# EAGLE schematic HendiRemote (EAGLE 9.6.2)
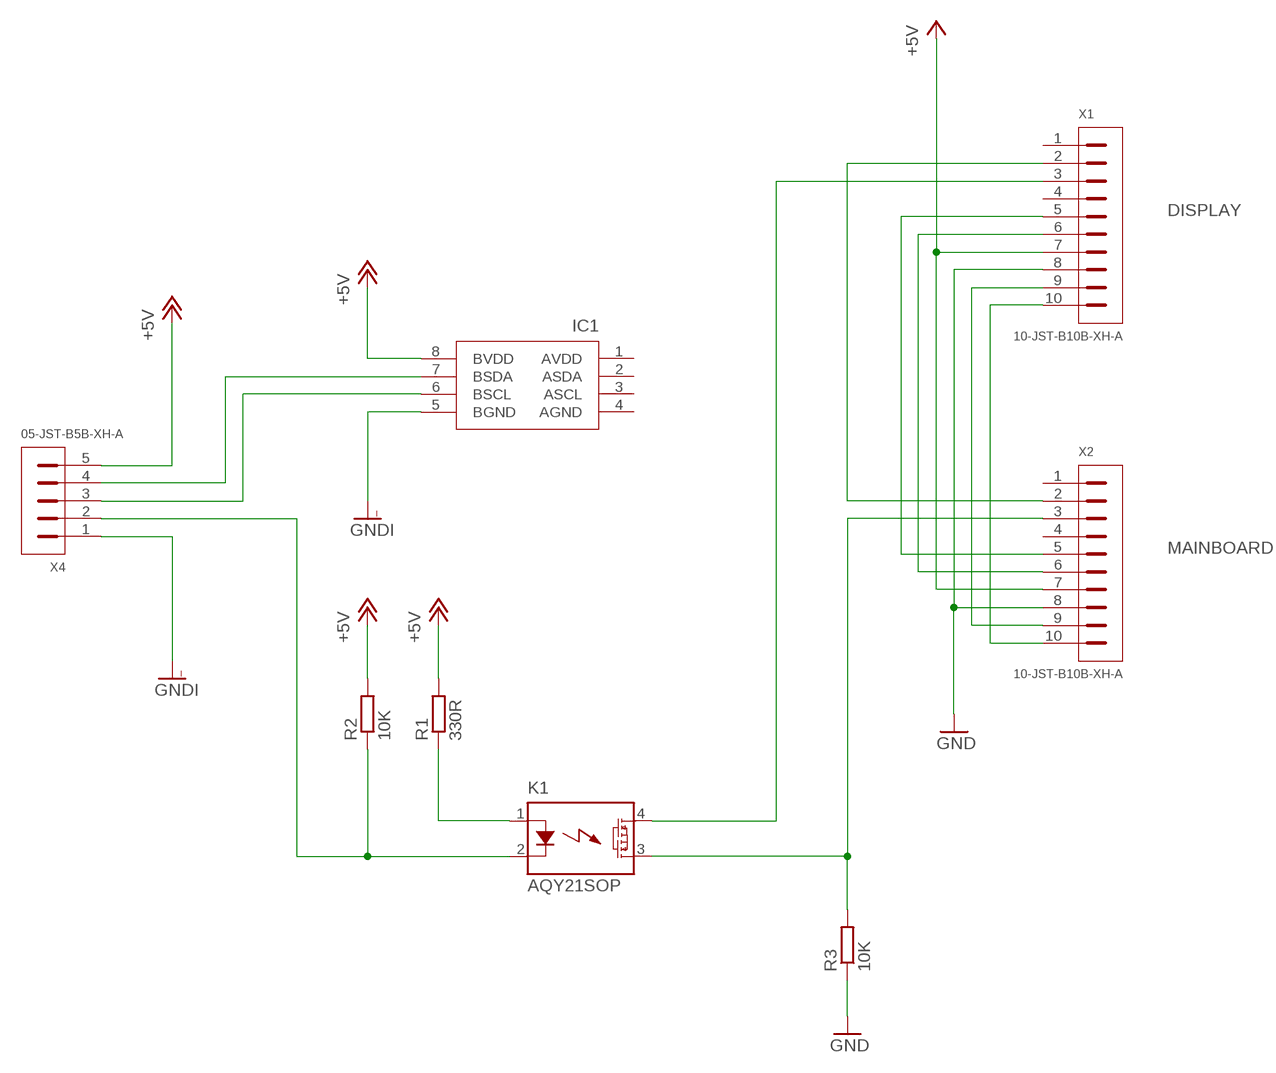
[diagram p0: schematic, sheet 1]

## Parts
IC1  SI8600  [SO08]
K1  AQY21SOP  [SOP04]
R1  330R  R-EU_R0805  [R0805]
R2  10K  R-EU_R0805  [R0805]
R3  10K  R-EU_R0805  [R0805]
X1  10-JST-B10B-XH-A  [B10B-XH]
X2  10-JST-B10B-XH-A  [B10B-XH]
X4  05-JST-B5B-XH-A  [B5B-XH]

## Nets
+5V: X1.7 X2.7
+5V_I: IC1.8(BVDD) ; supply symbol labelled +5V
+5VI: X4.5 ; supply symbol labelled +5V
+12V: R1.2 R2.2 ; supply symbol labelled +5V
GND: R3.1 X1.8 X2.8
GNDI: IC1.5(BGND) X4.1
N$1: X1.10 X2.10
N$2: X1.9 X2.9
N$3: IC1.7(BSDA) X4.4
N$4: IC1.6(BSCL) X4.3
N$5: X1.5 X2.5
N$6: K1.1(A) R1.1
N$7: K1.3(DS2) R3.2 X2.3
N$8: X1.2 X2.2
N$9: K1.2(K) R2.1 X4.2
N$10: X1.6 X2.6
N$11: K1.4(DS1) X1.3
Unconnected: IC1.1(AVDD) IC1.2(ASDA) IC1.3(ASCL) IC1.4(AGND) X1.1 X1.4 X2.1 X2.4

## Notes on the sheet
- DISPLAY
- MAINBOARD

## Library data of the parts
IC1 = rca-silicon-labs:SI8600
K1 = relay:AQY*: PhotoMOS Relay NAiS Source: http://www.panasonic-electric-works.com/catalogues/downloads/photomos/ds_x615_en_aqz10_20.pdf; OC_FARNELL: unknown; OC_NEWARK: unknown
R1-R3 = rcl:R-EU_: RESISTOR, European symbol; SPICEPREFIX: R
X1 X2 = con-jst-xh:10-JST: JST CONNECTOR
X4 = con-jst-xh:05-JST: JST CONNECTOR